# EAGLE design source_eagle (EAGLE 9.6.2)
AUTHOR: ladyada
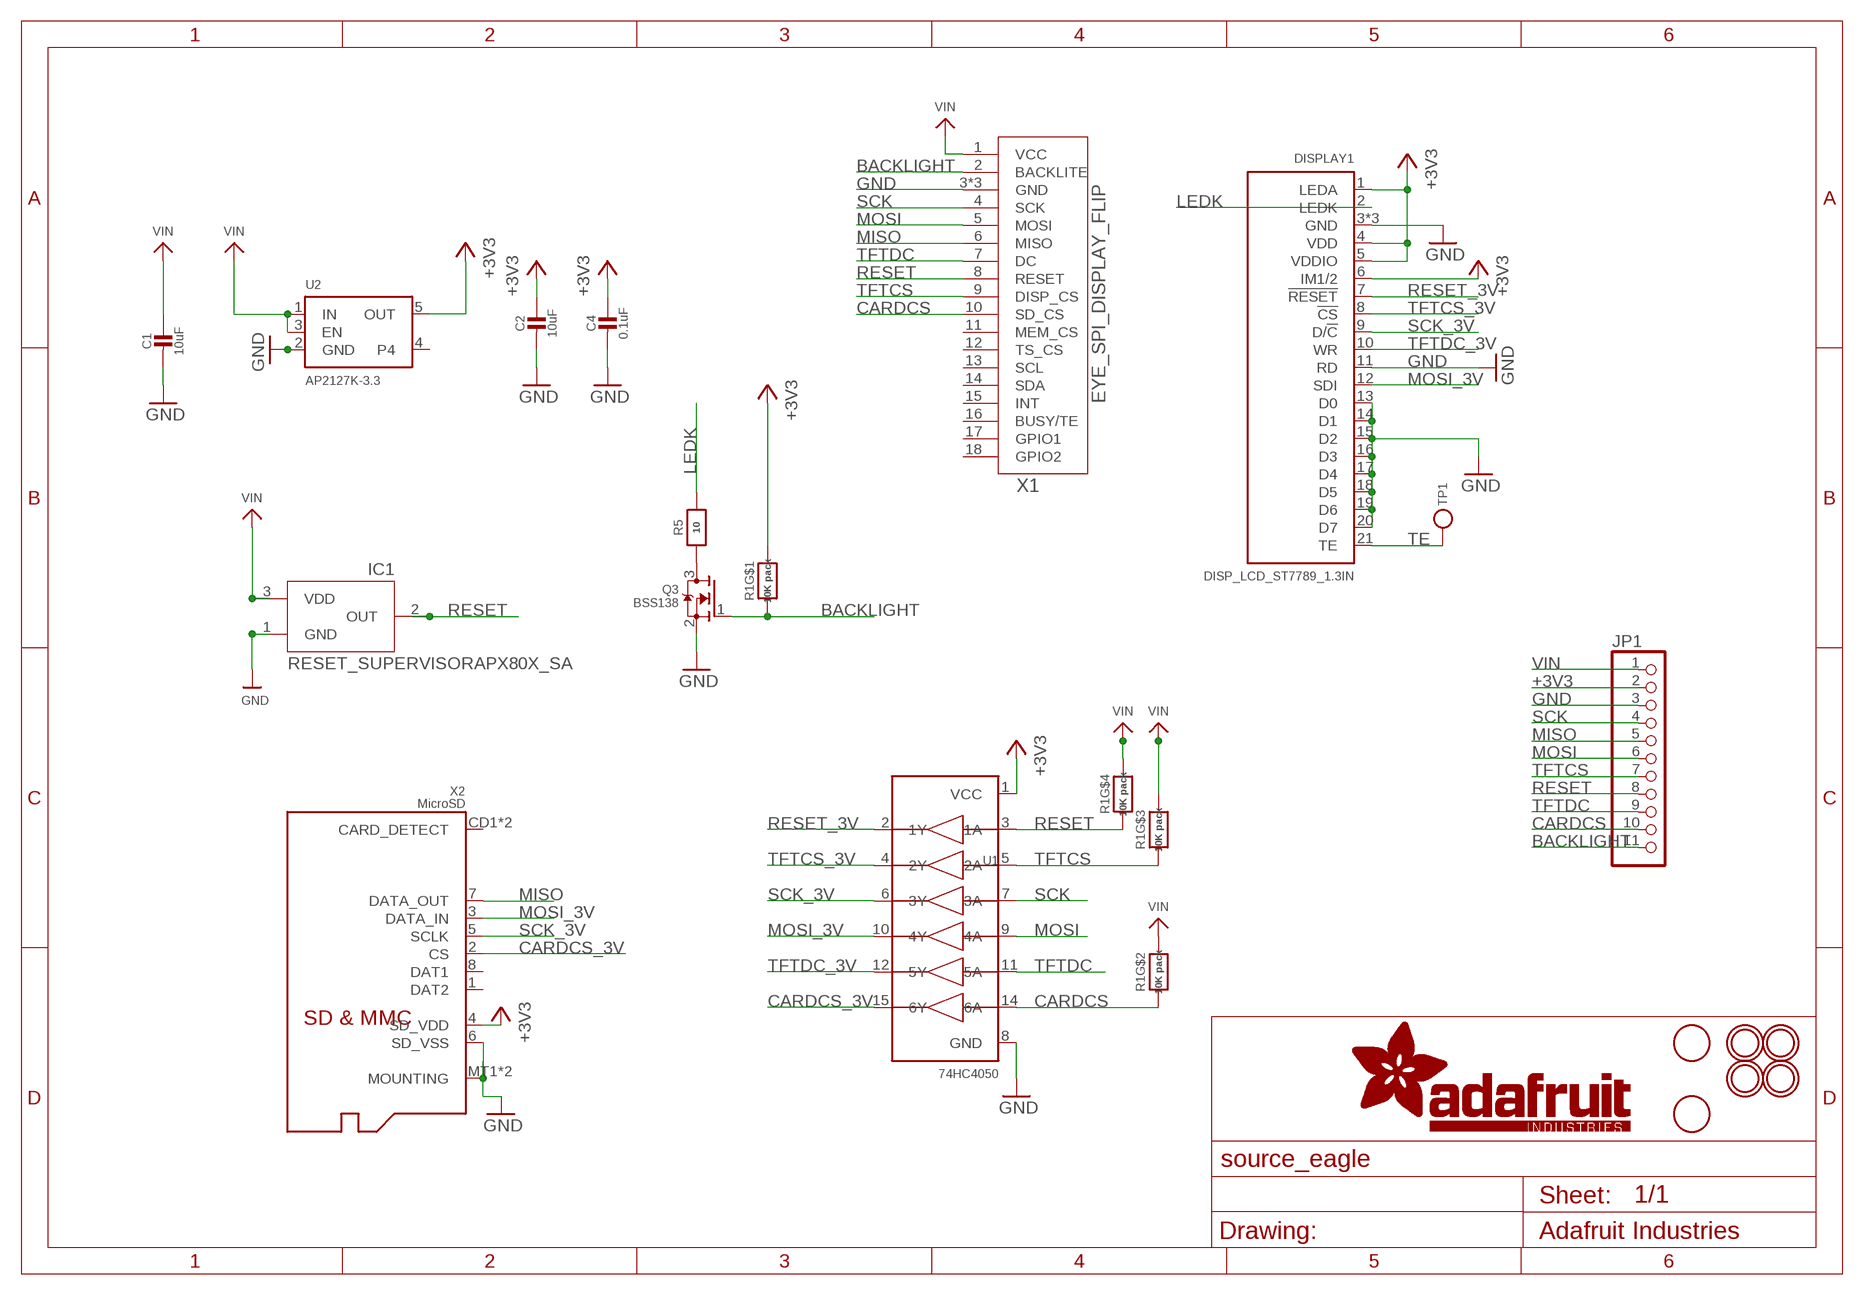
[diagram p0: schematic, sheet 1]

## Parts
C1  10uF  CAP_CERAMIC0805-NOOUTLINE  [0805-NO]
C2  10uF  CAP_CERAMIC0805-NOOUTLINE  [0805-NO]
C4  0.1uF  CAP_CERAMIC0603_NO  [0603-NO]
DISPLAY1  DISP_LCD_ST7789_1.3IN  [TFT_1.3IN_240X240_24P]
IC1  RESET_SUPERVISORAPX80X_SA  [SOT23-WIDE]
JP1  HEADER-1X1176MIL  [1X11_ROUND_76]
Q3  BSS138  MOSFET-NWIDE  [SOT23-WIDE]
R1  10K pack  RESISTOR_4PACK  [RESPACK_4X0603]
R5  10  RESISTOR_0603_NOOUT  [0603-NO]
TP1  TESTPOINTROUND1.5MM  [TESTPOINT_ROUND_1.5MM]
U1  74HC4050  74HC4050DTSSOP  [TSSOP16]
U2  AP2127K-3.3  VREG_SOT23-5  [SOT23-5]
U$4  FIDUCIAL  [FIDUCIAL_1MM]
U$5  FIDUCIAL  [FIDUCIAL_1MM]
U$7  MOUNTINGHOLE2.5  [MOUNTINGHOLE_2.5_PLATED]
U$8  MOUNTINGHOLE2.5  [MOUNTINGHOLE_2.5_PLATED]
U$9  MOUNTINGHOLE2.5  [MOUNTINGHOLE_2.5_PLATED]
U$10  MOUNTINGHOLE2.5  [MOUNTINGHOLE_2.5_PLATED]
X1  EYE_SPI_DISPLAY_FLIP  [EYE_SPI_DISPLAY_BOTCONTACT]
X2  MicroSD  MICROSD  [MICROSD]

## Nets
+3V3 [power]: C2.1 C4.1 DISPLAY1.1(LEDA) DISPLAY1.4(VDD) DISPLAY1.5(VDDIO) DISPLAY1.6(IM1/2) JP1.2 R1.8 U1.1(VCC) U2.5(OUT) X2.4(SD_VDD)
BACKLIGHT: JP1.11 Q3.1(G) R1.1 X1.2(BACKLITE)
CARDCS: JP1.10 R1.2 U1.14(6A) X1.10(SD_CS)
CARDCS_3V: U1.15(6Y) X2.2(CS)
GND: C1.2 C2.2 C4.2 DISPLAY1.3(GND) DISPLAY1.11(RD) DISPLAY1.13(D0) DISPLAY1.14(D1) DISPLAY1.15(D2) DISPLAY1.16(D3) DISPLAY1.17(D4) DISPLAY1.18(D5) DISPLAY1.19(D6) DISPLAY1.20(D7) DISPLAY1.23(GND) DISPLAY1.24(GND) IC1.1(GND) JP1.3 Q3.2(S) U1.8(GND) U2.2(GND) X1.3(GND) X1.SUPPORT1(GND) X1.SUPPORT2(GND) X2.6(SD_VSS) X2.MT1(MOUNTING) X2.MT2(MOUNTING)
LEDK: DISPLAY1.2(LEDK) R5.2
MISO: JP1.5 X1.6(MISO) X2.7(DATA_OUT)
MOSI: JP1.6 U1.9(4A) X1.5(MOSI)
MOSI_3V: DISPLAY1.12(SDI) U1.10(4Y) X2.3(DATA_IN)
N$1: Q3.3(D) R5.1
RESET: IC1.2(OUT) JP1.8 R1.4 U1.3(1A) X1.8(RESET)
RESET_3V: DISPLAY1.7(!RESET) U1.2(1Y)
SCK: JP1.4 U1.7(3A) X1.4(SCK)
SCK_3V: DISPLAY1.9(D/!C) U1.6(3Y) X2.5(SCLK)
TE: DISPLAY1.21(TE) TP1.P$1
TFTCS: JP1.7 R1.3 U1.5(2A) X1.9(DISP_CS)
TFTCS_3V: DISPLAY1.8(!CS) U1.4(2Y)
TFTDC: JP1.9 U1.11(5A) X1.7(DC)
TFTDC_3V: DISPLAY1.10(WR) U1.12(5Y)
VIN [power]: C1.1 IC1.3(VDD) JP1.1 R1.5 R1.6 R1.7 U2.1(IN) U2.3(EN) X1.1(VCC)
Unconnected: U2.4 X1.11(MEM_CS) X1.12(TS_CS) X1.13(SCL) X1.14(SDA) X1.15(INT) X1.16(BUSY/TE) X1.17(GPIO1) X1.18(GPIO2) X2.1(DAT2) X2.8(DAT1) X2.CD1(CARD_DETECT) X2.CD2(CARD_DETECT)

## Library data of the parts
C1 C2 C4 = microbuilder:CAP_CERAMIC: Ceramic Capacitors For new designs, use the packages preceded by an '_' character since they are more reliable: The following footprints should be used on most boards: _0402 - Standard footprint for regular board layouts _0603 - Standard footprint for regular board layouts _0805 - Standard footprint for regular board layouts _1206 - Standard footprint for regular board layouts For extremely tight-pitch boards where space is at a premium, the following 'micro-pitch' footprints can be used (smaller pads, no silkscreen outline, etc.): _0402MP - Micro-pitch footprint for very dense/compact boards _0603MP - Micro-pitch footprint for very dense/compact boards _0805MP - Micro-pitch footprint for very dense/compact boards _1206MP - Micro-pitch footprint for very dense/compact boards
DISPLAY1 = adafruit_display:DISP_LCD_ST7789_1.3IN
IC1 = adafruit_power:RESET_SUPERVISOR; ROT: 270
JP1 = microbuilder:HEADER-1X11
Q3 = microbuilder:MOSFET-N: N-Channel Mosfet LEGEND VDS: Voltage Drain-Source ID: Drain Current RDS(ON): Drain-Source On-State Resistance VGS(TH): Gate-Source Threshold Voltage CISS: Drain-Source Input Capacitance SOT-23 Name VDS ID RDS(ON) VGS(TH) CISS Order Number 2N7002E 60V 260mA 2.5 Ohm 2.5V @ 250uA 26.7pF @ 25V 2N7002ET1GOSTR-ND BSH103 30V 850mA 400 mOhm 400mV @ 1mA 83pF @ 24V BSH103,235-ND BSS138 60V 320mA 1.6 Ohm 1.5V @ 250uA 50pF @ 10V Mouser: 771-BSS138PW115 DMN2075U-7 20V 4.2A 38 mOhm 1V @ 250 uA 594.3pF @ 10V DMN2075U-7DICT-ND * BSS138 good choice for I2C level-shifting POWERPAK 1212-8 Name VDS ID RDS(ON) VGS(TH) CISS Order Number Si7308DN 60V 6A 58 mOhm 3V @ 250uA 665pF @ 15V SI7308DN-T1-E3CT-ND
R1 = microbuilder:RESISTOR_4PACK: Resistor Packs (4 resistors) 4 x 0603 10K 1/16W - Digikey: YC164J-10KCT-ND
R5 = microbuilder:RESISTOR: Resistors For new designs, use the packages preceded by an '_' character since they are more reliable: The following footprints should be used on most boards: _0402 - Standard footprint for regular board layouts _0603 - Standard footprint for regular board layouts _0805 - Standard footprint for regular board layouts _1206 - Standard footprint for regular board layouts For extremely tight-pitch boards where space is at a premium, the following 'micro-pitch' footprints can be used (smaller pads, no silkscreen outline, etc.): _0402MP - Micro-pitch footprint for very dense/compact boards _0603MP - Micro-pitch footprint for very dense/compact boards _0805MP - Micro-pitch footprint for very dense/compact boards _1206MP - Micro-pitch footprint for very dense/compact boards
TP1 = microbuilder:TESTPOINT: Test Point Various test points for characterisation and PCB testing TESTPOINT_SMT - Compact Surface Mount Test Point [Digikey: 5016KTR-ND]
U1 = microbuilder:74HC4050D: 6-channel level shifter 74HC4050D - 2V-6V Supply SOIC16 Digikey: 74HC4050D,653-ND Mouser: 771-74HC4050D-T TSSOP16 Digikey: 296-9215-1-ND Mouser:
U2 = adafruit_power:VREG_SOT23-5: SOT23-5 Fixed Voltage Regulators Part Current Out V Out V In V Dropout θJA (°C/W) TJ (°C) Digikey Part No. ADP121 150mA 3.3V 3.4-5.5V 0.09V @ 150mA -- -- ADP121-AUJZ33R7CT-ND ADP121 150mA 3.0V 3.1-5.5V 0.09V @ 150mA -- -- ADP121-AUJZ30R7CT-ND ADP122 300mA 3.3V 3.4-5.5V 0.085V @ 300mA -- -- ADP122AUJZ-3.3-R7CT-ND ADP1712 300mA 3.3V 3.5-5.5V 0.17V @ 300mA -- -- ADP1712AUJZ-3.3-R7TR-ND AP7311 (Low Cost) 150mA 3.3V 3.5-6V 0.15V @ 150mA -- -- AP7311-33WG-7DICT-ND LD39015M18R 150mA 1.8V 1.9V-5.5V 0.08V @ 100mA -- -- 497-6977-1-ND LP2985A-33DBVR 150mA 3.3V 3.3-16V 0.28V @ 150mA 206 150 296-18479-1-ND MCP1824T-3302E/OT 300mA 3.3V 3.5V-6V 0.2V @ 300mA -- -- MCP1824T-3302E/OTCT-ND MIC5205-2.5YM5 TR 150mA 2.5V 2.7-16V 0.165V @ 150mA -- -- 576-1257-2-ND MIC5205-3.0YM5 TR 150mA 3.0V 3.2V-16V 0.165V @ 150mA -- -- 576-1258-2-ND MIC5205-3.3YM5 TR 150mA 3.3V 3.5V-16V 0.165V @ 150mA -- -- 576-1259-2-ND TPS780330220 150mA 3.3V+2.2V 3.6-5.5V 250mV Max -- -- 296-23332-1-ND TDA3663/N1,135 100mA 3.3V 3.5-45V 0.18V @ 50mA -- -- 568-5343-1-ND Max operating temp can be calculated using θJA, TJ (max junction temperature), and power in watts. Set the "Maximum Ambient Temperature" until it reaches TJ ("Max Junction Temperature"), which is the absolute limit for safe use of the regulator: Heat Sink Temperature Calculator <http://www.daycounter.com/Calculators/Heat-Sink-Temperature-Calculator.phtml> For example, With 12V source into a 3.3V LP2985 and a 30mA load, we are dissipating (12V-3.3V) * 0.03A = 0.261W. With a θJA of 206 °C/W, a TJ of 150°C, and 261mW we can safely use the chip without a heat sink up to 75°C (=147.1°C Junction Temperature).; JLC_ROTATION: 270
U$4 U$5 = adafruit:FIDUCIAL: For use by pick and place machines to calibrate the vision/machine, 1mm By microbuilder.eu
U$7-U$10 = adafruit_electromech:MOUNTINGHOLE: Mounting Hole For #2 screws (0.086"/2.18mm width, 0.094"/2.4mm hole) use 2.5mm; BOM: EXCLUDE
X1 = adafruit_display:EYE_SPI_DISPLAY; LCSC: C2856802
X2 = adafruit_electromech:MICROSD: MicroSD/Transflash Card Holder with SPI pinout 3M: 2908-05WB-MG 4UConnector: 19656 Footprint courtesy: Adafruit Industries; JLC_ROTATION: 90; LCSC: C125617

## Net classes
1 power: width 0.254 mm

## Board
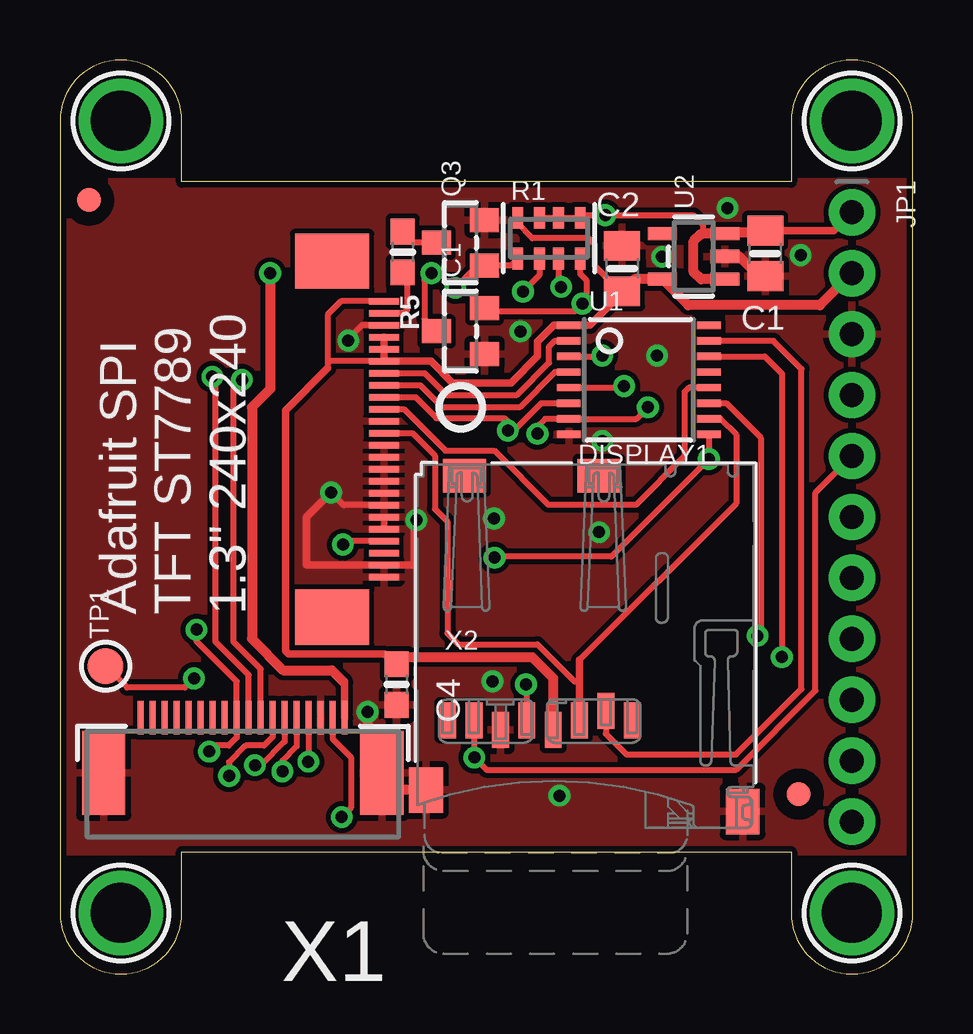
[diagram p1: board, top side]
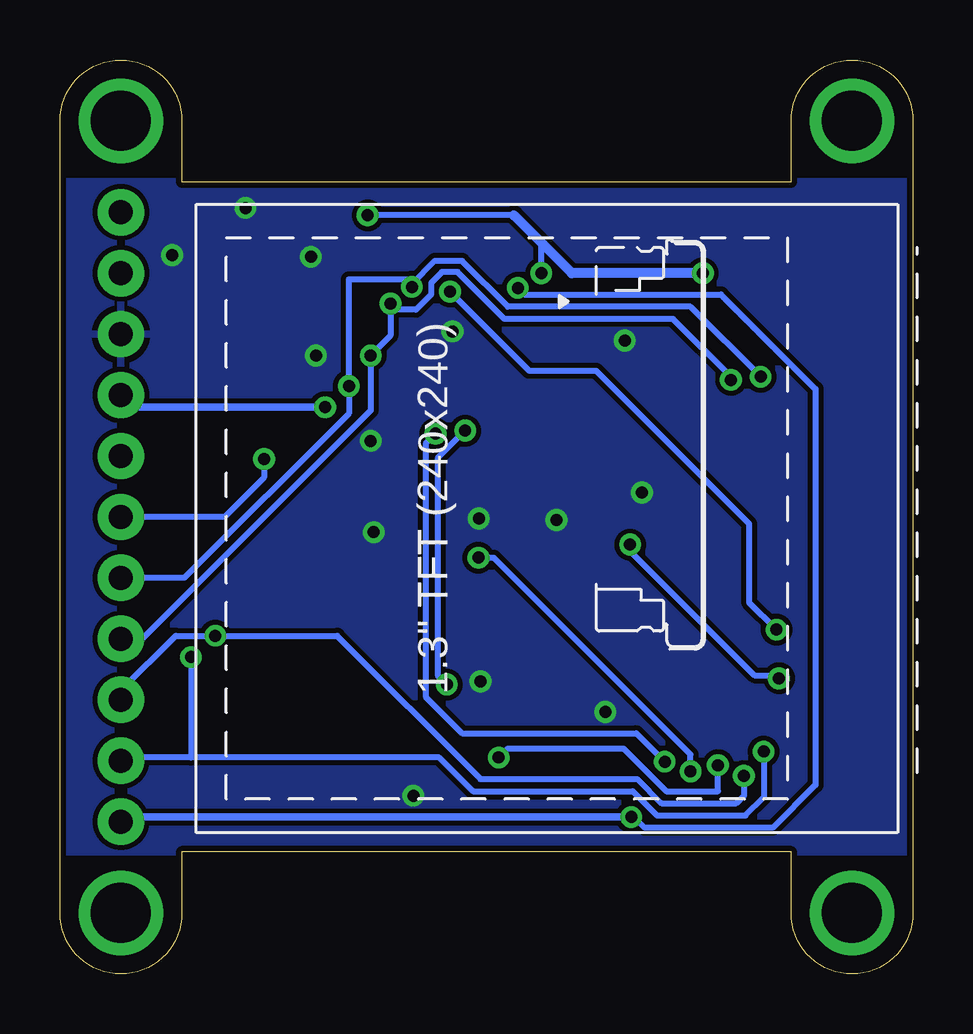
[diagram p2: board, bottom side, seen from below]

Size 35.56 x 38.1 mm. Coordinates in mm from the lower left corner, seen from the top.
Outline: 30.48,5.08 30.48,2.54 arc90 33.02,0 arc90 35.56,2.54 35.56,35.56 arc90 33.02,38.1 arc90 30.48,35.56 30.48,33.02 5.08,33.02 5.08,35.56 arc90 2.54,38.1 arc90 0,35.56 0,2.54 arc90 2.54,0 arc90 5.08,2.54 5.08,5.08 30.48,5.08
Copper layers (1*16): Top 0.035mm / dielectric 1.5mm / Bottom 0.035mm
Design rules "adafruit *": minimum track width 8mil, minimum drill 15.5mil, track to track 8mil, track to pad 8mil, pad to pad 8mil, via to via 8mil, smd to smd 8mil, copper to edge 10mil, drill to drill 8mil, minimum pad ring 10mil, minimum via ring 8mil, stop-mask expansion 2mil, vias tented up to drill 20mil, thermal gap 10mil

### Footprints (pad centres in the part's own frame; a part is rotated, then mirrored left to right if it is on the bottom)
0805-NO = smd 1.24 x 1.5: 1 -0.95,0; 2 0.95,0
0603-NO = smd 1.075 x 1: 1 -0.85,0; 2 0.85,0
TFT_1.3IN_240X240_24P = smd 0.28 x 1.25: 1 -5.75,0.616; 2 -5.25,0.616; 3 -4.75,0.616; 4 -4.25,0.616; 5 -3.75,0.616; 6 -3.25,0.616; 7 -2.75,0.616; 8 -2.25,0.616; 9 -1.75,0.616; 10 -1.25,0.616; 11 -0.75,0.616; 12 -0.25,0.616; 13 0.25,0.616; 14 0.75,0.616; 15 1.25,0.616; 16 1.75,0.616; 17 2.25,0.616; 18 2.75,0.616; 19 3.25,0.616; 20 3.75,0.616; 21 4.25,0.616; 22 4.75,0.616; 23 5.25,0.616; 24 5.75,0.616 | smd 2.3 x 3.1: MNT1 -7.42,-1.548; MNT2 7.42,-1.548
SOT23-WIDE = smd 1 x 1.2: 1 -0.95,-1; 2 0.95,-1; 3 0,1
1X11_ROUND_76 = drill 1 pad 1.93: 1 -12.7,0; 2 -10.16,0; 3 -7.62,0; 4 -5.08,0; 5 -2.54,0; 6 0,0; 7 2.54,0; 8 5.08,0; 9 7.62,0; 10 10.16,0; 11 12.7,0
RESPACK_4X0603 = smd 0.45 x 0.9: 1 -1.3,-0.85; 2 -0.4,-0.85; 3 0.4,-0.85; 4 1.3,-0.85; 5 1.3,0.85; 6 0.4,0.85; 7 -0.4,0.85; 8 -1.3,0.85
TESTPOINT_ROUND_1.5MM = smd 1.5 x 1.5: P$1 0,0
TSSOP16 = smd 0.305 x 0.991: 1 -2.275,-2.918; 2 -1.625,-2.918; 3 -0.975,-2.918; 4 -0.325,-2.918; 5 0.325,-2.918; 6 0.975,-2.918; 7 1.625,-2.918; 8 2.275,-2.918; 9 2.275,2.918; 10 1.625,2.918; 11 0.975,2.918; 12 0.325,2.918; 13 -0.325,2.918; 14 -0.975,2.918; 15 -1.625,2.918; 16 -2.275,2.918
SOT23-5 = smd 0.55 x 1.2: 1 -0.95,-1.3; 2 0,-1.3; 3 0.95,-1.3; 4 0.95,1.3; 5 -0.95,1.3
FIDUCIAL_1MM = smd 1 x 1: 1 0,0
MOUNTINGHOLE_2.5_PLATED = drill 2.5 pad 3.2: P$1 0,0
EYE_SPI_DISPLAY_BOTCONTACT = smd 0.25 x 1.4: 1 4.25,1.154; 2 3.75,1.154; 3 3.25,1.154; 4 2.75,1.154; 5 2.25,1.154; 6 1.75,1.154; 7 1.25,1.154; 8 0.75,1.154; 9 0.25,1.154; 10 -0.25,1.154; 11 -0.75,1.154; 12 -1.25,1.154; 13 -1.75,1.154; 14 -2.25,1.154; 15 -2.75,1.154; 16 -3.25,1.154; 17 -3.75,1.154; 18 -4.25,1.154 | smd 1.8 x 3.5: SUPPORT1 -5.8,-1.152; SUPPORT2 5.8,-1.152
MICROSD = smd 0.7 x 1.5: 1 1.761,-3.147; 2 0.661,-2.747; 3 -0.439,-3.147; 4 -1.539,-3.547; 5 -2.639,-3.147; 6 -3.739,-3.547; 7 -4.839,-3.147; 8 -5.939,-3.147 | smd 1.8 x 1.4: CD1 -5.239,7.053; CD2 0.38,7.053 | smd 1.4 x 1.9: MT1 -6.839,-6.047; MT2 6.361,-6.947

### Placement (x,y rotation side)
C1  29.4,30.04 270 top
C2  23.43,29.4 90 top
C4  14.03,12.07 270 top
DISPLAY1  12.89,22.29 270 top
IC1  16.7,26.8 90 top
JP1  33.02,19.05 270 top
PLABEL0  [PLABEL0]  29.78,31.75 0 top
PLABEL1  [PLABEL1]  29.34,13.53 0 top
PLABEL2  [PLABEL2]  29.08,10.86 0 top
PLABEL3  [PLABEL3]  29.27,8.57 0 top
PLABEL4  [PLABEL4]  29.21,16 0 top
PLABEL5  [PLABEL5]  31.75,17.46 90 top
PLABEL6  [PLABEL6]  29.21,23.69 0 top
PLABEL7  [PLABEL7]  29.27,21.08 0 top
PLABEL8  [PLABEL8]  29.91,5.4 0 top
PLABEL9  [PLABEL9]  28.96,26.23 0 top
PLABEL10  [PLABEL10]  31.75,27.94 90 top
PLABEL11  [PLABEL11]  1.65,11.11 0 top
PLABEL13  [PLABEL13]  5.97,12.38 0 top
PLABEL14  [PLABEL14]  34.73,30.48 90 bottom
PLABEL15  [PLABEL15]  31.56,27.88 90 bottom
PLABEL16  [PLABEL16]  34.73,25.02 90 bottom
PLABEL17  [PLABEL17]  31.31,22.61 90 bottom
PLABEL18  [PLABEL18]  34.73,20.64 90 bottom
PLABEL19  [PLABEL19]  31.24,18.41 90 bottom
PLABEL20  [PLABEL20]  34.73,15.11 90 bottom
PLABEL21  [PLABEL21]  31.31,12.7 90 bottom
PLABEL22  [PLABEL22]  34.86,10.1 90 bottom
PLABEL23  [PLABEL23]  31.11,7.3 90 bottom
PLABEL24  [PLABEL24]  34.8,4.95 90 bottom
Q3  16.7,30.48 90 top
R1  20.38,30.67 0 top
R5  14.29,30.1 270 top
TP1  1.91,12.83 90 top
U1  24.13,24.77 270 top
U2  26.42,29.91 90 top
U$2  [PCBFEAT-REV-040]  16.7,23.62 0 top
U$4  1.21,32.26 0 top
U$5  30.8,7.49 0 top
U$7  2.54,35.56 0 top
U$8  2.54,2.54 0 top
U$9  33.02,35.56 0 top
U$10  33.02,2.54 0 top
X1  7.62,9.53 0 top
X2  22.1,13.72 0 top

### Tracks (layer width: path | path; a pad name or v marks a point on that pad's centre or on a via)
+3V3
  Top 0.254: C2.1 23.37,28.45 22.29,29.53 22.29,30.42 22.04,30.67 19.68,30.67 19.08,31.27 R1.8 | DISPLAY1.1 11.72,28.04 11.16,27.48 11.16,25.53 | C4.1 14.03,12.83 14.1,12.89 | 11.16,25.53 11.16,25.26 | 11.16,25.53 11.23,25.53 11.24,25.54 DISPLAY1.6
  Top 0.305: C2.1 23.43,28.38 22.09,27.04 U1.1 20.59,27.04 19.9,26.36 19.9,25.75 18.79,24.64 16.36,24.64 15.46,25.54 DISPLAY1.6 DISPLAY1.5 DISPLAY1.4 | 14.03,12.83 13.53,13.34 9.53,13.34 9.4,13.47 9.4,23.49 11.16,25.26
  Top 0.406: C2.1 23.94,28.96 U2.5 26.2,27.88 31.69,27.88 JP1.2 | X2.4 20.56,12.33 19.68,13.21 14.41,13.21 14.1,12.89
BACKLIGHT  (via drill 0.5)
  Top 0.254: R1.1 18.79,29.53 Q3.1 17.41,29.53 v16.48,28.6 | X1.2 11.37,9.79 12.13,9.03 12.13,6.92 v11.75,6.54
  Bottom 0.254: v16.48,28.6 16.2,28.32 8,28.32 4.06,24.38 4.06,7.87 5.84,6.1 11.18,6.1 11.62,6.54 v11.75,6.54
  Bottom 0.305: JP1.11 32.83,6.54 v11.75,6.54
CARDCS  (via drill 0.5)
  Top 0.254: U1.14 29.38,25.74 30.1,25.02 30.1,13.59 | 30.1,13.59 v30.1,13.21 | 30.1,13.59 | R1.2 19.98,29.13 v19.3,28.45 | v6.22,9.27 6.48,9.53 7.04,9.53 7.37,9.85 X1.10 7.37,12.18 5.69,13.86 v5.69,14.35
  Bottom 0.254: v30.1,13.21 30.1,9.02 | 30.1,9.02 19.75,9.02 18.35,7.62 11.68,7.62 10.67,6.6 6.99,6.6 6.22,7.37 v6.22,9.27 | 30.1,9.02 32.89,9.02 JP1.10 | 30.1,9.02 | v19.3,28.45 16,25.15 13.21,25.15 6.83,18.77 6.83,15.49 v5.69,14.35
CARDCS_3V
  Top 0.254: X2.2 22.76,10.01 23.62,9.14 28.18,9.14 30.91,11.87 30.91,25.22 29.74,26.39 U1.15
GND  (via drill 0.5)
  Top 0.254: DISPLAY1.3 12.59,27.04 12.02,26.47 v12.02,26.4 | DISPLAY1.19 DISPLAY1.20 | DISPLAY1.18 11.83,19.54 v11.3,20.07 | 14.73,18.92 14.73,17.04
  Top 0.305: v11.3,20.07 10.29,19.05 10.29,17.04 DISPLAY1.23 14.73,17.04
  Top 0.406: C1.2 29.14,29.09 28.32,29.91 U2.2 | X2.MT1 13.42,7.67 X1.SUPPORT2 13.04,8.37 12.83,8.59 v12.83,10.92
  other vias: 14.86,18.92 18.03,12.19 30.88,29.96 19.19,26.79 18.1,18.99 22.48,18.41 20.83,7.43 25.1,29.9 27.83,31.93 24.89,25.78 22.61,22.23
  pour Top: 0,5.08 0,33.02 35.56,33.02 35.56,5.08
  pour Bottom: 35.56,5.08 0,5.08 0,33.02 35.56,33.02
LEDK
  Top 0.254: R5.2 14.48,29.06 14.48,27.69 14.33,27.54 DISPLAY1.2
MISO  (via drill 0.5)
  Top 0.254: X2.7 v17.26,9.03 v17.27,9.02 17.78,8.51 28.19,8.51 31.5,11.81 31.5,20.07 JP1.5 | X1.6 9.37,9.69 8.38,8.7 v8.13,8.7
  Bottom 0.254: v17.27,9.02 16.89,9.4 12.06,9.4 10.29,7.62 8.13,7.62 v8.13,8.7
MOSI  (via drill 0.5)
  Top 0.254: U1.9 27.05,21.59 | v27.05,21.46 22.99,17.4 18.16,17.4 v18.11,17.35 | X1.5 9.87,9.49 9.27,8.89 v9.27,8.45
  Top 0.305: v27.05,21.46 27.05,21.59
  Bottom 0.254: v27.05,21.46 27.05,20.7 28.7,19.05 JP1.6 | v9.27,8.45 9.27,9.14 17.48,17.35 v18.11,17.35
MOSI_3V
  Top 0.254: U1.10 27.53,23.14 28.19,22.48 28.19,19.62 | 28.19,19.62 21.66,13.08 | 28.19,19.62 | 21.66,12.19 21.45,12.19 19.91,13.74 16.61,13.74 16.15,14.2 16.15,18.87 15.63,19.39 15.63,21.61 14.7,22.54 DISPLAY1.12
  Top 0.305: X2.3 21.66,12.19 21.66,13.08
N$1
  Top 0.254: Q3.3 14.76,30.48 R5.1
RESET  (via drill 0.5)
  Top 0.254: U1.3 22.57,25.74 v22.61,25.78 | 18.12,27.62 21.46,27.62 v21.78,27.94 21.94,28.1 21.94,28.93 21.68,29.19 R1.4 | X1.8 8.37,12.71 7.24,13.84 7.24,24.38 7.59,24.73 v7.59,24.77
  Top 0.406: IC1.2 17.99,27.75 18.12,27.62
  Bottom 0.254: v22.61,25.78 22.61,23.49 32.13,13.97 JP1.8 | v21.78,27.94 21.78,27.69 | 21.78,27.69 21.78,26.61 22.38,26 | v7.59,24.77 7.59,24.89 10,27.3 17.03,27.3 18.98,29.26 19.63,29.26 20.09,28.81 20.09,28.32 20.72,27.69 21.78,27.69
  Bottom 0.305: v22.61,25.78 22.38,26
RESET_3V
  Top 0.254: U1.2 20.62,26.39 20.39,26.16 20.39,25.48 19.05,24.14 16.11,24.14 15.21,25.04 DISPLAY1.7
SCK  (via drill 0.5)
  Top 0.254: v24.51,23.62 24.03,23.14 U1.7 20.22,23.14 19.81,22.73 19.81,22.61 v19.91,22.52 | X1.4 10.37,8.87 v10.35,8.85
  Bottom 0.254: v19.91,22.52 20.32,22.1 20.32,11.56 18.8,10.03 11.54,10.03 v10.35,8.85
  Bottom 0.305: JP1.4 32.51,23.62 v24.51,23.62
SCK_3V  (via drill 0.5)
  Top 0.254: U1.6 20.07,23.79 18.93,22.65 v18.67,22.65 18.67,23.03 18.53,23.17 15.7,23.17 14.82,24.04 DISPLAY1.9 | X2.5 19.46,12.04
  Top 0.305: 19.46,12.04 v19.43,12.07
  Bottom 0.254: v18.67,22.65 19.81,21.5 19.81,12.45 v19.43,12.07
TE  (via drill 0.5)
  Top 0.254: DISPLAY1.21 12.06,18.04 11.92,17.9 v11.79,17.9 | TP1.P$1 2.79,11.94 5.21,11.94 v5.59,12.32
  Bottom 0.254: v11.79,17.9 11.73,17.96 11.73,17.57 6.6,12.45 5.71,12.45 v5.59,12.32
TFTCS  (via drill 0.5)
  Top 0.254: U1.5 23.45,24.44 v23.52,24.51 | R1.3 20.78,28.8 20.89,28.7 v20.89,28.64 | X1.9 7.87,12.46 6.47,13.85 6.47,24.77 v6.35,24.89
  Bottom 0.254: JP1.7 30.37,16.51 23.52,23.37 v23.52,24.51 23.52,28.96 21.08,28.96 20.89,28.77 | v20.89,28.64 20.95,28.7 20.89,28.77 | v6.35,24.89 9.27,27.81 16.89,27.81 18.8,29.72 19.94,29.72 20.89,28.77
TFTCS_3V
  Top 0.254: U1.4 20.64,25.09 19.19,23.64 15.92,23.64 15.02,24.54 DISPLAY1.8
TFTDC  (via drill 0.5)
  Top 0.254: U1.11 27.77,23.79 29.21,22.35 29.21,14.1 | X1.7 8.87,9.89 8.51,9.53 7.75,9.53 7.05,8.83 v7.05,8.25
  Top 0.305: v29.08,14.1 29.21,14.1
  Bottom 0.254: JP1.9 33.02,11.81 30.73,14.1 v29.08,14.1 24,14.1 18.03,8.13 11.49,8.13 10.48,7.11 7.37,7.11 7.05,7.43 v7.05,8.25
TFTDC_3V
  Top 0.254: U1.12 26.22,24.44 26.04,24.26 26.04,21.59 24,19.56 20.36,19.56 18.11,21.81 16.07,21.81 14.34,23.54 DISPLAY1.10
VIN  (via drill 0.5)
  Top 0.254: R1.7 R1.6 R1.5 21.68,31.62 v22.73,31.62 | v22.73,31.62 26.42,31.62 26.8,31.24 26.8,30.86 | v15.49,29.21 15.19,28.91 15.19,27.3 IC1.3 | v22.73,31.63 v22.73,31.62
  Top 0.305: C1.1 32.26,30.98 JP1.1 | X1.1 11.87,12.13 11.81,12.19
  Top 0.406: C1.1 29.34,30.92 27.78,30.92 U2.3 | 11.81,12.19 11.34,12.66 9.31,12.66 8,13.97 8,23.62 8.76,24.38 v8.76,29.21 | U2.1 26.73,28.96 26.42,29.27 26.42,30.54 26.73,30.86 26.8,30.86 U2.3 | U2.3
  Bottom 0.254: v15.49,29.21 15.49,30.48 16.64,31.63 v22.73,31.63
  Bottom 0.406: v8.76,29.21 14.22,29.21 16.64,31.63

### Text on the board
tPlace: Adafruit SPI / TFT ST7789 / 1.3" 240x240
Pinguin_tBackup: Vin | 3Vo | Gnd | SCK | MIS | MOS | TCS | RST | EYESPI | D/C | TE | SCS | LIT
Pinguin_bBackup: 3v3 | Vin | Gnd | SCK | SO | SI | TCS | RST | D/C | CCS | Lite